# EAGLE schematic Schematic_LEDversion1 (EAGLE 9.2.0)
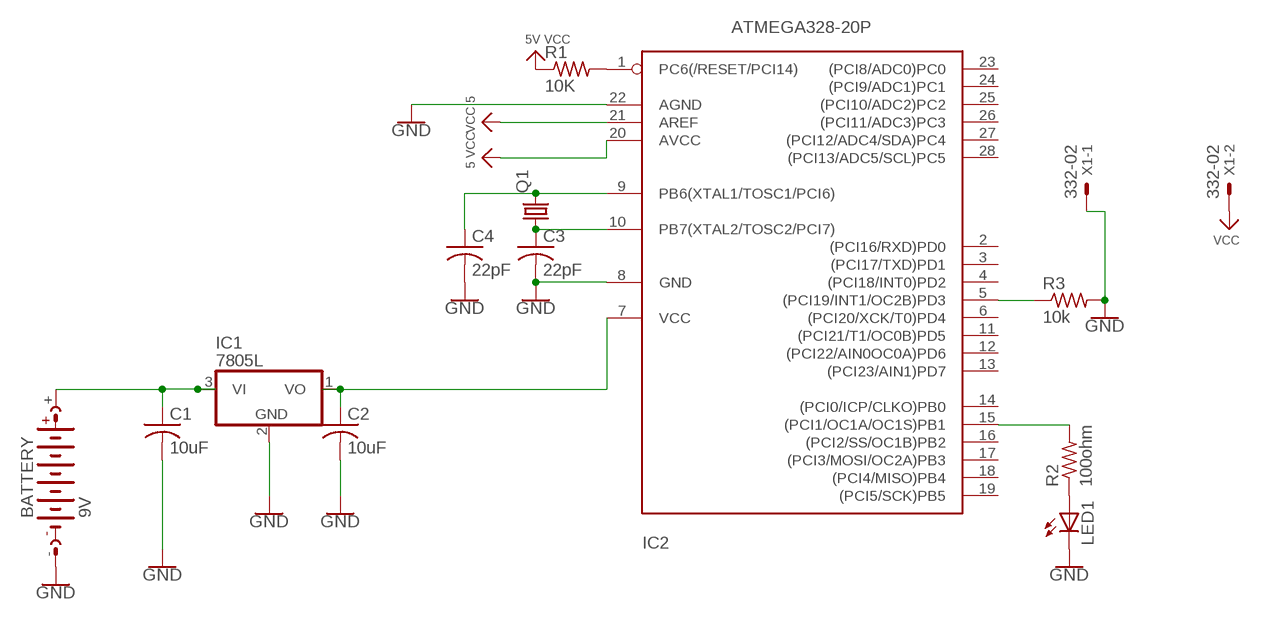
[diagram p0: schematic, sheet 1]

## Parts
BATTERY  9V  AB9V  [AB9V]
C1  10uF  C-US025-040X050  [C025-040X050]
C2  10uF  C-US025-040X050  [C025-040X050]
C3  22pF  C-US025-040X050  [C025-040X050]
C4  22pF  C-US025-040X050  [C025-040X050]
IC1  7805L  [TO92]
IC2  ATMEGA328-20P  [DIL28-3]
LED1  LED5MM  [LED5MM]
Q1  CRYSTALHC49S  [HC49/S]
R1  10K  R-US_0207/12  [0207/12]
R2  100ohm  R-US_0207/12  [0207/12]
R3  10k  R-US_0207/12  [0207/12]
X1  332-02  [332-02]

## Nets
GND: BATTERY.- C1.2 C2.2 C3.2 C4.2 IC1.2(GND) IC2.8(GND) IC2.22(AGND) LED1.K(C) R3.2 X1.1
N$1: IC2.1(PC6(/RESET/PCI14)) R1.2
N$2: C4.1 IC2.9(PB6(XTAL1/TOSC1/PCI6)) Q1.2
N$3: C3.1 IC2.10(PB7(XTAL2/TOSC2/PCI7)) Q1.1
N$4: BATTERY.+ C1.1 IC1.3(VI)
N$5: C2.1 IC1.1(VO) IC2.7(VCC)
N$6: IC2.5((PCI19/INT1/OC2B)PD3) R3.1
N$7: IC2.15((PCI1/OC1A/OC1S)PB1) R2.2
N$8: LED1.A R2.1
VCC: IC2.20(AVCC) IC2.21(AREF) R1.1 X1.2 ; supply symbol labelled 5V VCC, VCC 5, 5 VCC
Unconnected: IC2.2((PCI16/RXD)PD0) IC2.3((PCI17/TXD)PD1) IC2.4((PCI18/INT0)PD2) IC2.6((PCI20/XCK/T0)PD4) IC2.11((PCI21/T1/OC0B)PD5) IC2.12((PCI22/AIN0OC0A)PD6) IC2.13((PCI23/AIN1)PD7) IC2.14((PCI0/ICP/CLKO)PB0) IC2.16((PCI2/SS/OC1B)PB2) IC2.17((PCI3/MOSI/OC2A)PB3) IC2.18((PCI4/MISO)PB4) IC2.19((PCI5/SCK)PB5) IC2.23((PCI8/ADC0)PC0) IC2.24((PCI9/ADC1)PC1) IC2.25((PCI10/ADC2)PC2) IC2.26((PCI11/ADC3)PC3) IC2.27((PCI12/ADC4/SDA)PC4) IC2.28((PCI13/ADC5/SCL)PC5)

## Library data of the parts
BATTERY = battery:AB9V: 9-V BATTERY CLIP
C1-C4 = adafruit:C-US: CAPACITOR, American symbol
IC1 = adafruit:78*: Positive VOLTAGE REGULATOR Added bigger pads to the TO-92 package
IC2 = atmega328:ATMEGA328*P: MICROCONTROLLER 32 kBytes FLASH 2 kBytes SRAM 1 kBytes EEPROM USART 8-channel 10 bit ADC
LED1 = adafruit:LED: LED OSRAM: - CHIPLED LG R971, LG N971, LY N971, LG Q971, LY Q971, LO R971, LY R971 LH N974, LH R974 LS Q976, LO Q976, LY Q976 LO Q996 - Hyper CHIPLED LW Q18S LB Q993, LB Q99A, LB R99A - SideLED LS A670, LO A670, LY A670, LG A670, LP A670 LB A673, LV A673, LT A673, LW A673 LH A674 LY A675 LS A676, LA A676, LO A676, LY A676, LW A676 LS A679, LY A679, LG A679 - Hyper Micro SIDELED® LS Y876, LA Y876, LO Y876, LY Y876 LT Y87S - SmartLED LW L88C, LW L88S LB L89C, LB L89S, LG L890 LS L89K, LO L89K, LY L89K LS L896, LA L896, LO L896, LY L896 - TOPLED LS T670, LO T670, LY T670, LG T670, LP T670 LSG T670, LSP T670, LSY T670, LOP T670, LYG T670 LG T671, LOG T671, LSG T671 LB T673, LV T673, LT T673, LW T673 LH T674 LS T676, LA T676, LO T676, LY T676, LB T676, LH T676, LSB T676, LW T676 LB T67C, LV T67C, LT T67C, LS T67K, LO T67K, LY T67K, LW E67C LS E67B, LA E67B, LO E67B, LY E67B, LB E67C, LV E67C, LT E67C LW T67C LS T679, LY T679, LG T679 LS T770, LO T770, LY T770, LG T770, LP T770 LB T773, LV T773, LT T773, LW T773 LH T774 LS E675, LA E675, LY E675, LS T675 LS T776, LA T776, LO T776, LY T776, LB T776 LHGB T686 LT T68C, LB T68C - Hyper Mini TOPLED® LB M676 - Mini TOPLED Santana® LG M470 LS M47K, LO M47K, LY M47K Source: http://www.osram.convergy.de/
Q1 = adafruit:CRYSTAL: CRYSTAL; OC_FARNELL: 1667008; OC_NEWARK: unknown
R1 R2 = adafruit:R-US_: RESISTOR, American symbol
R3 = adafruit:R-US_: RESISTOR, American symbol; SPICEPREFIX: R
X1 = con-garry:332-02: 2 Pin - 2mm Dual Row Source: www.mpe-connector.de / garry_shortform_2012.pdf

## Net classes
0 default: width 0.508 mm, clearance 0.508 mm